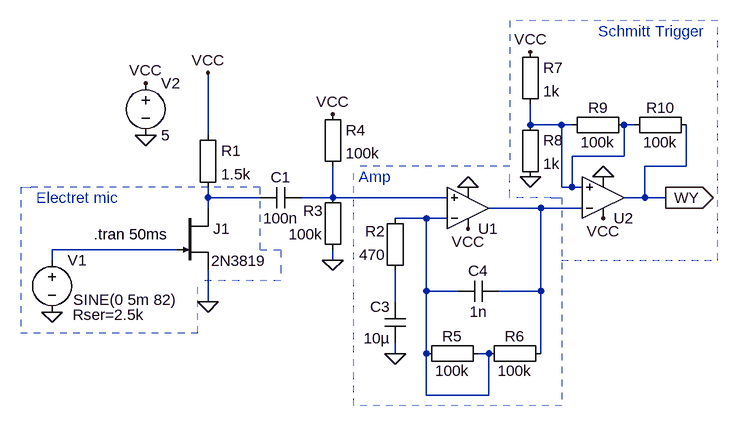
[diagram p0: schematic Electret_mic_amp.asc]
Electret_mic_amp.asc, the LTspice schematic file:
Version 4.1
SHEET 1 964 680
WIRE 656 96 656 64
WIRE 704 96 656 96
WIRE 720 96 704 96
WIRE 816 96 800 96
WIRE 160 112 160 16
WIRE 800 144 800 96
WIRE 800 144 720 144
WIRE 896 160 896 96
WIRE 896 160 832 160
WIRE 704 192 704 96
WIRE 720 192 720 144
WIRE 720 192 704 192
WIRE 736 192 720 192
WIRE 160 208 160 192
WIRE 240 208 160 208
WIRE 352 208 352 160
WIRE 352 208 304 208
WIRE 528 208 352 208
WIRE 832 208 832 160
WIRE 832 208 800 208
WIRE 864 208 832 208
WIRE 160 224 160 208
WIRE 672 224 592 224
WIRE 736 224 672 224
WIRE 496 240 448 240
WIRE 528 240 496 240
WIRE 112 288 -80 288
WIRE -80 304 -80 288
WIRE 352 304 352 288
WIRE 496 352 496 240
WIRE 544 352 496 352
WIRE 672 352 672 224
WIRE 672 352 608 352
WIRE 160 368 160 320
WIRE 448 368 448 320
WIRE 448 448 448 432
WIRE 496 448 496 352
WIRE 592 448 576 448
WIRE 672 448 672 352
WIRE 496 512 496 448
WIRE 592 512 592 448
WIRE 592 512 496 512
FLAG 64 112 0
FLAG 352 304 0
FLAG 560 192 0
FLAG 64 32 VCC
FLAG 160 16 VCC
FLAG 560 256 VCC
FLAG 352 80 VCC
FLAG 448 448 0
FLAG -80 384 0
FLAG 768 240 VCC
FLAG 768 176 0
FLAG 656 176 0
FLAG 656 -16 VCC
FLAG 864 208 WY
IOPIN 864 208 Out
FLAG 160 368 0
SYMBOL voltage -80 288 R0
WINDOW 3 33 77 Left 2
WINDOW 123 26 90 Left 2
WINDOW 39 32 100 Left 2
SYMATTR Value SINE(0 5m 82)
SYMATTR SpiceLine Rser=2.5k
SYMATTR InstName V1
SYMBOL voltage 64 16 R0
WINDOW 123 0 0 Left 0
WINDOW 39 0 0 Left 0
SYMATTR InstName V2
SYMATTR Value 5
SYMBOL njf 112 224 R0
WINDOW 3 53 81 Left 2
SYMATTR Value 2N3819
SYMATTR InstName J1
SYMBOL Misc\\EuropeanResistor 144 96 R0
SYMATTR InstName R1
SYMATTR Value 1.5k
SYMBOL cap 304 192 R90
WINDOW 0 0 32 VBottom 2
WINDOW 3 32 32 VTop 2
SYMATTR InstName C1
SYMATTR Value 100n
SYMBOL Misc\\EuropeanResistor 368 304 R180
WINDOW 0 31 76 Left 2
WINDOW 3 31 40 Left 2
SYMATTR InstName R3
SYMATTR Value 100k
SYMBOL OpAmps\\UniversalOpAmp2 560 224 M180
SYMATTR InstName U1
SYMATTR Value2 Avol=300k GBW=1Meg Slew=600k
SYMATTR SpiceLine Ilimit=25m Rail=0 Vos=2m
SYMBOL Misc\\EuropeanResistor 592 432 R90
WINDOW 0 5 56 VBottom 2
WINDOW 3 27 56 VTop 2
SYMATTR InstName R5
SYMATTR Value 100k
SYMBOL Misc\\EuropeanResistor 464 336 R180
WINDOW 0 31 76 Left 2
WINDOW 3 31 40 Left 2
SYMATTR InstName R2
SYMATTR Value 470
SYMBOL Misc\\EuropeanResistor 336 64 R0
SYMATTR InstName R4
SYMATTR Value 100k
SYMBOL cap 464 432 R180
WINDOW 0 24 56 Left 2
WINDOW 3 24 8 Left 2
SYMATTR InstName C3
SYMATTR Value 10µ
SYMBOL cap 544 368 R270
WINDOW 0 32 32 VTop 2
WINDOW 3 0 32 VBottom 2
SYMATTR InstName C4
SYMATTR Value 1n
SYMBOL OpAmps\\UniversalOpAmp2 768 208 M180
SYMATTR InstName U2
SYMATTR Value2 Avol=300k GBW=1Meg Slew=600k
SYMATTR SpiceLine Ilimit=25m Rail=0 Vos=2m
SYMBOL Misc\\EuropeanResistor 640 -32 R0
SYMATTR InstName R7
SYMATTR Value 1k
SYMBOL Misc\\EuropeanResistor 640 80 R0
SYMATTR InstName R8
SYMATTR Value 1k
SYMBOL Misc\\EuropeanResistor 688 432 R90
WINDOW 0 5 56 VBottom 2
WINDOW 3 27 56 VTop 2
SYMATTR InstName R6
SYMATTR Value 100k
SYMBOL Misc\\EuropeanResistor 816 80 R90
WINDOW 0 5 56 VBottom 2
WINDOW 3 27 56 VTop 2
SYMATTR InstName R9
SYMATTR Value 100k
SYMBOL Misc\\EuropeanResistor 912 80 R90
WINDOW 0 5 56 VBottom 2
WINDOW 3 27 56 VTop 2
SYMATTR InstName R10
SYMATTR Value 100k
TEXT -16 264 Left 2 !.tran 50ms
TEXT -104 208 Left 2 ;Electret mic
TEXT 392 176 Left 2 ;Amp
TEXT 760 -48 Left 2 ;Schmitt Trigger
LINE Normal 240 192 -112 192 2
LINE Normal 624 160 384 160 2
LINE Normal 624 208 624 160 2
LINE Normal 688 208 624 208 2
LINE Normal 624 -64 624 160 2
LINE Normal -128 192 -112 192 2
LINE Normal 240 288 240 192 2
LINE Normal 144 416 144 336 2
LINE Normal -128 416 144 416 2
LINE Normal -128 192 -128 416 2
LINE Normal 272 336 144 336 2
LINE Normal 272 288 272 336 2
LINE Normal 240 288 272 288 2
LINE Normal 944 -64 624 -64 2
LINE Normal 944 304 944 -64 2
LINE Normal 384 528 384 160 2
LINE Normal 704 528 384 528 2
LINE Normal 704 208 704 528 2
LINE Normal 688 208 704 208 2
LINE Normal 704 304 944 304 2

The netlist it stands for:
* Electret_mic_amp.asc
V1 N006 0 SINE(0 5m 82) Rser=2.5k
V2 VCC 0 5
J1 N002 N006 0 2N3819
R1 VCC N002 1.5k
C1 N003 N002 100n
R3 0 N003 100k
X§U1 N003 N005 VCC 0 N004 level2 Avol=300k GBW=1Meg Slew=600k Ilimit=25m Rail=0 Vos=2m En=0 Enk=0 In=0 Ink=0 Rin=500Meg  ; pins In+ In- V+ V- OUT
R5 N005 N005 100k
R2 N007 N005 470
R4 VCC N003 100k
C3 0 N007 10µ
C4 N005 N004 1n
X§U2 N001 N004 VCC 0 WY level2 Avol=300k GBW=1Meg Slew=600k Ilimit=25m Rail=0 Vos=2m En=0 Enk=0 In=0 Ink=0 Rin=500Meg  ; pins In+ In- V+ V- OUT
R7 VCC N001 1k
R8 N001 0 1k
R6 N004 N005 100k
R9 N001 N001 100k
R10 WY N001 100k
.model NJF NJF
.model PJF PJF
.lib standard.jft
.tran 50ms
* Electret mic
* Amp
* Schmitt Trigger
.lib UniversalOpAmp2.lib
.backanno
.end